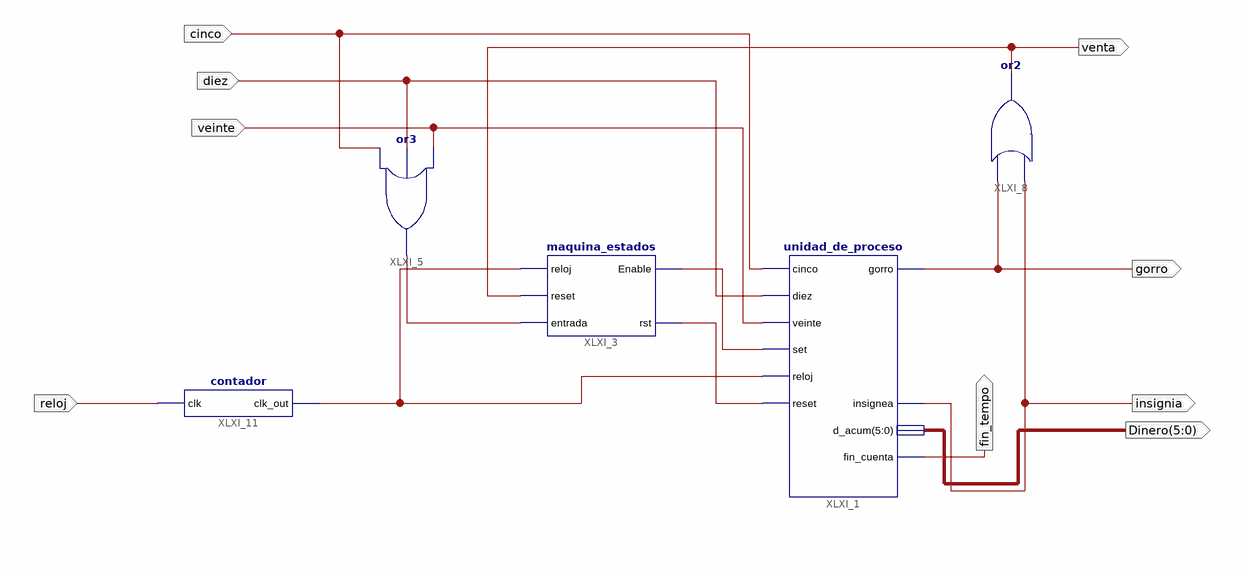
[diagram p0: schematic sheet 1]
// Xilinx ISE schematic Maquina_Expendedora.sch (spartan6) as structural Verilog: 5 symbols, 9 ports
module Maquina_Expendedora (
  input  cinco,
  input  diez,
  input  veinte,
  input  reloj,
  output fin_tempo,
  output gorro,
  output insignia,
  output venta,
  output [5:0] Dinero
);

  wire bus_enable, bus_entrada, bus_reset, XLXN_11;

  unidad_de_proceso XLXI_1 (
    .cinco(cinco), .diez(diez), .veinte(veinte), .set(bus_enable), .reset(bus_reset), .reloj(XLXN_11),
    .d_acum(Dinero), .gorro(gorro), .insignea(insignia), .fin_cuenta(fin_tempo));
  maquina_estados XLXI_3 (.reloj(XLXN_11), .reset(venta), .entrada(bus_entrada), .Enable(bus_enable), .rst(bus_reset));
  or XLXI_5 (bus_entrada, cinco, diez, veinte);
  or XLXI_8 (venta, insignia, gorro);
  contador XLXI_11 (.clk(reloj), .clk_out(XLXN_11));
endmodule
